# EAGLE design c (EAGLE 7.5.0)
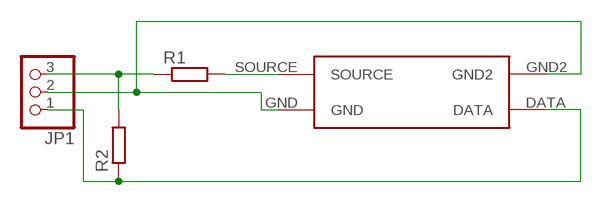
[diagram p0: schematic, sheet 1]

## Parts
JP1  PINHD-1X3  [1X03]
R1  R-EU_M1206  [M1206]
R2  R-EU_M1206  [M1206]
U$1  GP2S24  [GP2S24]

## Nets
N$1: JP1.3 R1.1 R2.2
N$2: R1.2 U$1.SOURCE
N$3: JP1.2 U$1.GND U$1.GND2
N$4: JP1.1 R2.1 U$1.DATA

## Library data of the parts
JP1 = pinhead:PINHD-1X3: PIN HEADER
R1 R2 = resistor:R-EU_: RESISTOR, European symbol
U$1 = gp2s24:GP2S24

## Board
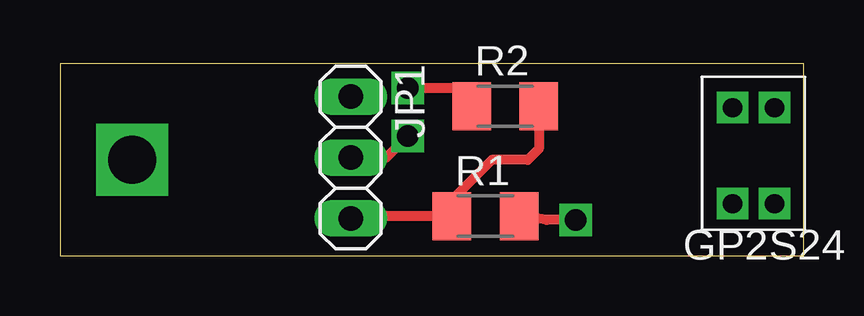
[diagram p1: board, top side]
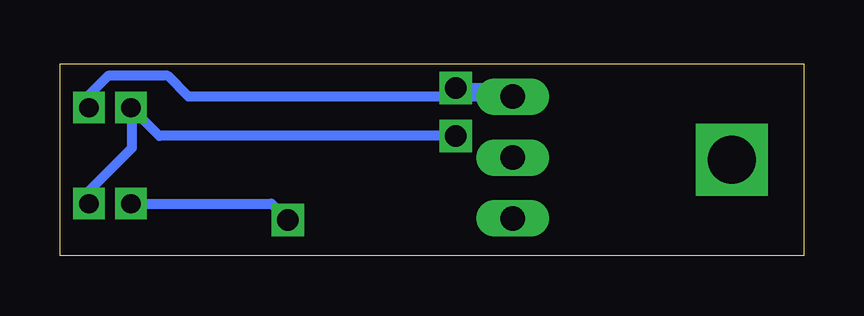
[diagram p2: board, bottom side, seen from below]

Size 31 x 8 mm. Coordinates in mm from the lower left corner, seen from the top.
Outline: 0,0 31,0 31,8 0,8 0,0
Copper layers (1*16): Top 0.035mm / dielectric 1.5mm / Bottom 0.035mm
Design rules "default": minimum track width 10mil, minimum drill 24mil, track to track 8mil, track to pad 8mil, pad to pad 8mil, via to via 8mil, smd to smd 8mil, copper to edge 40mil, drill to drill 8mil, minimum pad ring 10mil, minimum via ring 8mil, stop-mask expansion 4mil, vias tented up to drill 0mil, thermal gap 10mil

### Footprints (pad centres in the part's own frame; a part is rotated, then mirrored left to right if it is on the bottom)
1X03 = drill 1.016 long: 1 -2.54,0; 2 0,0; 3 2.54,0
M1206 = smd 1.6 x 2: 1 -1.4,0; 2 1.4,0
GP2S24 = drill 0.8 square: DATA 0,0; GND 1.75,0; GND2 0,4; SOURCE 1.75,4

### Placement (x,y rotation side)
JP1  12.12,4.1 270 top
R1  17.74,1.66 0 top
R2  18.56,6.24 0 top
U$1  29.79,6.18 180 top

### Tracks (layer width: path | path; a pad name or v marks a point on that pad's centre or on a via)
N$1
  Top 0.406: JP1.3 12.22,1.66 R1.1 16,2 18,4 19.5,4 19.96,4.46 R2.2
N$2  (via drill 0.9)
  Top 0.406: v21.5,1.5 20.3,1.5 R1.2
  Bottom 0.406: U$1.SOURCE 22.18,2.18 v21.5,1.5
N$3  (via drill 0.9)
  Top 0.406: JP1.2 13.6,4.1 v14.5,5
  Bottom 0.406: v14.5,5 26.86,5 U$1.GND 28,6.14 28,4.5 29.79,2.71 U$1.GND2
N$4  (via drill 0.9)
  Top 0.406: v14.5,7 16.4,7 R2.1
  Bottom 0.406: U$1.DATA 29.79,6.71 29,7.5 26.5,7.5 25.64,6.64 JP1.1 12.48,7 v14.5,7
N$5  (via drill 2)
  other vias: 3,4